# EAGLE schematic trainer2 (EAGLE 7.3.0)
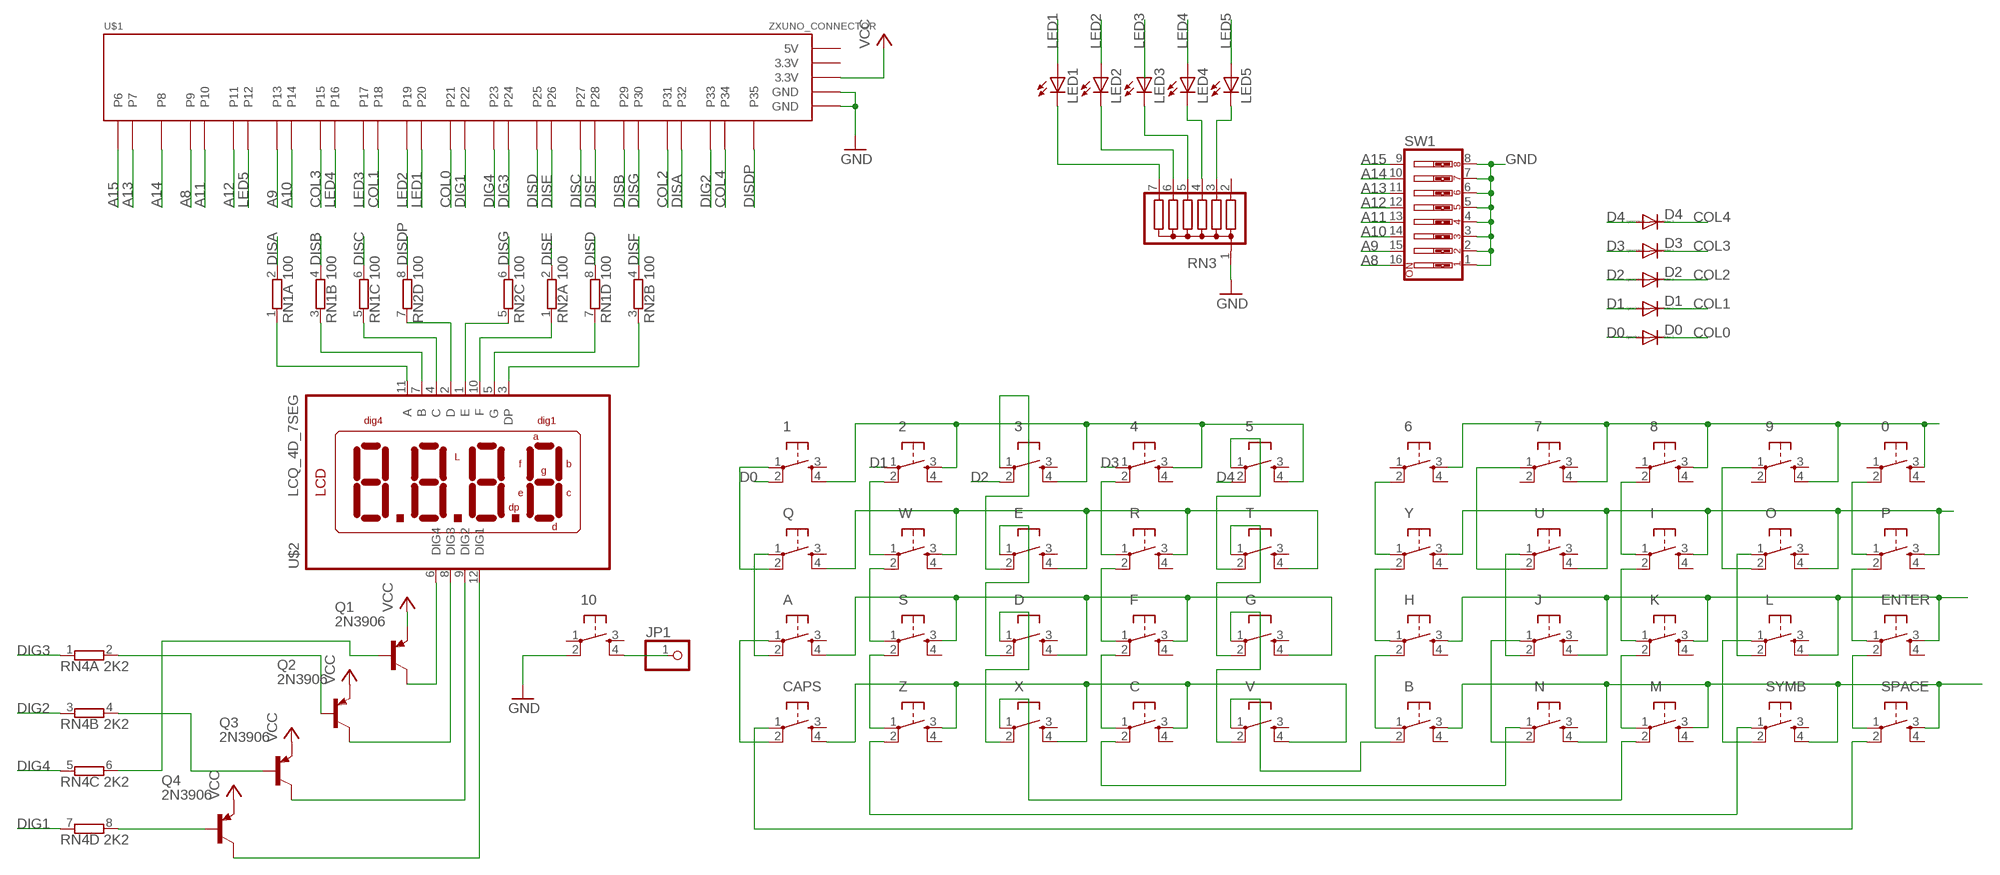
[diagram p0: schematic, sheet 1]

## Parts
0  DTS-6  [DTS-6]
1  DTS-6  [DTS-6]
2  DTS-6  [DTS-6]
3  DTS-6  [DTS-6]
4  DTS-6  [DTS-6]
5  DTS-6  [DTS-6]
6  DTS-6  [DTS-6]
7  DTS-6  [DTS-6]
8  DTS-6  [DTS-6]
9  DTS-6  [DTS-6]
10  DTS-6  [DTS-6]
A  DTS-6  [DTS-6]
B  DTS-6  [DTS-6]
C  DTS-6  [DTS-6]
CAPS  DTS-6  [DTS-6]
D  DTS-6  [DTS-6]
D0  1N4148DO35-7  [DO35-7]
D1  1N4148DO35-7  [DO35-7]
D2  1N4148DO35-7  [DO35-7]
D3  1N4148DO35-7  [DO35-7]
D4  1N4148DO35-7  [DO35-7]
E  DTS-6  [DTS-6]
ENTER  DTS-6  [DTS-6]
F  DTS-6  [DTS-6]
G  DTS-6  [DTS-6]
H  DTS-6  [DTS-6]
I  DTS-6  [DTS-6]
J  DTS-6  [DTS-6]
JP1  PINHD-1X1  [1X01]
K  DTS-6  [DTS-6]
L  DTS-6  [DTS-6]
LED1  LED3MM  [LED3MM]
LED2  LED3MM  [LED3MM]
LED3  LED3MM  [LED3MM]
LED4  LED3MM  [LED3MM]
LED5  LED3MM  [LED3MM]
M  DTS-6  [DTS-6]
N  DTS-6  [DTS-6]
O  DTS-6  [DTS-6]
P  DTS-6  [DTS-6]
Q  DTS-6  [DTS-6]
Q1  2N3906  [TO92]
Q2  2N3906  [TO92]
Q3  2N3906  [TO92]
Q4  2N3906  [TO92]
R  DTS-6  [DTS-6]
RN1  100  E4R  [SIL8]
RN2  100  E4R  [SIL8]
RN3  G06R  [SIL7]
RN4  2K2  E4R  [SIL8]
S  DTS-6  [DTS-6]
SPACE  DTS-6  [DTS-6]
SW1  SW_DIP-8  [EDG-08]
SYMB  DTS-6  [DTS-6]
T  DTS-6  [DTS-6]
U  DTS-6  [DTS-6]
U$1  ZXUNO_CONNECTOR  [ZXUNO_CONNECTOR]
U$2  LCQ_4D_7SEG  [LDQ_4D_7SEG]
V  DTS-6  [DTS-6]
W  DTS-6  [DTS-6]
X  DTS-6  [DTS-6]
Y  DTS-6  [DTS-6]
Z  DTS-6  [DTS-6]

## Nets
A8: C.3 CAPS.4 SW1.16 U$1.P9 V.4 X.4 Z.3
A9: A.4 D.4 F.3 G.4 S.3 SW1.15 U$1.P13
A10: E.4 Q.4 R.3 SW1.14 T.4 U$1.P14 W.3
A11: 1.4 2.3 3.4 4.3 5.4 SW1.13 U$1.P10
A12: 0.3 6.3 7.4 8.3 9.4 SW1.12 U$1.P11
A13: I.3 O.4 P.3 SW1.11 U$1.P7 U.4 Y.3
A14: ENTER.3 H.3 J.4 K.3 L.4 SW1.10 U$1.P8
A15: B.3 M.3 N.4 SPACE.3 SW1.9 SYMB.4 U$1.P6
COL0: D0.C U$1.P21
COL1: D1.C U$1.P18
COL2: D2.C U$1.P31
COL3: D3.C U$1.P15
COL4: D4.C U$1.P34
D0: 1.2 D0.A
D1: 2.1 D1.A
D2: 3.2 D2.A
D3: 4.1 D3.A
D4: 5.2 D4.A
DIG1: RN4.7 U$1.P22
DIG2: RN4.3 U$1.P33
DIG3: RN4.1 U$1.P24
DIG4: RN4.5 U$1.P23
DISA: RN1.2 U$1.P32
DISB: RN1.4 U$1.P29
DISC: RN1.6 U$1.P27
DISD: RN1.8 U$1.P25
DISDP: RN2.8 U$1.P35
DISE: RN2.2 U$1.P26
DISF: RN2.4 U$1.P28
DISG: RN2.6 U$1.P30
ELETE: M.2 X.1
GND: 10.2 RN3.1 SW1.1 SW1.2 SW1.3 SW1.4 SW1.5 SW1.6 SW1.7 SW1.8 U$1.GND@1(GND) U$1.GND@2(GND)
LED1: LED1.A U$1.P20
LED2: LED2.A U$1.P19
LED3: LED3.A U$1.P17
LED4: LED4.A U$1.P16
LED5: LED5.A U$1.P12
N$1: Q1.1(C) U$2.6(DIG4)
N$2: Q2.1(C) U$2.8(DIG3)
N$3: Q3.1(C) U$2.9(DIG2)
N$4: Q4.1(C) U$2.12(DIG1)
N$5: Q2.2(B) RN4.2
N$6: Q1.2(B) RN4.6
N$7: Q3.2(B) RN4.4
N$8: Q4.2(B) RN4.8
N$9: RN1.1 U$2.11(A)
N$10: RN1.3 U$2.7(B)
N$11: RN1.5 U$2.4(C)
N$12: RN2.7 U$2.2(D)
N$13: RN2.5 U$2.1(E)
N$14: RN2.1 U$2.10(F)
N$15: 10.4 JP1.1
N$16: S.1 W.2
N$17: S.2 Z.1
N$18: RN2.3 U$2.3(DP)
N$19: SYMB.1 Z.2
N$20: RN1.7 U$2.5(G)
N$21: C.1 F.2
N$22: CAPS.1 SPACE.2
N$23: 4.2 R.1
N$24: F.1 R.2
N$25: LED4.K(C) RN3.4
N$26: LED5.K(C) RN3.3
N$27: LED3.K(C) RN3.5
N$28: B.2 V.1
N$29: 5.1 T.2
N$30: G.2 T.1
N$31: A.2 Q.1
N$32: J.2 U.1
N$33: J.1 N.2
N$34: 3.1 E.2
N$35: D.2 E.1
N$36: A.1 CAPS.2
N$37: 1.1 Q.2
N$38: K.2 M.1
N$39: 2.2 W.1
N$40: 7.1 U.2
N$41: LED2.K(C) RN3.6
N$42: G.1 V.2
N$43: C.2 N.1
N$44: L.1 SYMB.2
N$46: LED1.K(C) RN3.7
N$47: I.2 K.1
N$48: 8.2 I.1
N$49: L.2 O.1
N$50: B.1 H.2
N$51: H.1 Y.2
N$52: ENTER.2 SPACE.1
N$53: ENTER.1 P.2
N$54: 0.2 P.1
N$55: 6.2 Y.1
N$56: 9.1 O.2
N$74: D.1 X.2
VCC: Q1.3(E) Q2.3(E) Q3.3(E) Q4.3(E) U$1.3.3V@2(3.3V)
Unconnected: 0.1 0.4 1.3 2.4 3.3 4.4 5.3 6.1 6.4 7.2 7.3 8.1 8.4 9.2 9.3 10.1 10.3 A.3 B.4 C.4 CAPS.3 D.3 E.3 ENTER.4 F.4 G.3 H.4 I.4 J.3 K.4 L.3 M.4 N.3 O.3 P.4 Q.3 R.4 RN3.2 S.4 SPACE.4 SYMB.3 T.3 U.3 V.3 W.4 X.3 Y.4 Z.4

## Power pins joined to a net without a drawn wire
3.3V: U$1.3.3V@1(3.3V)
5V: U$1.5V

## Library data of the parts
0 1-10 A B C CAPS D E ENTER F G H I J K L M N O P Q R S SPACE SYMB T U V W X Y Z = switch-tact:DTS-6
D0 D1-D4 = diode:1N4148: DIODE high speed (Philips)
JP1 = pinhead:PINHD-1X1: PIN HEADER
LED1-LED5 = led:LED: LED OSRAM: - CHIPLED LG R971, LG N971, LY N971, LG Q971, LY Q971, LO R971, LY R971 LH N974, LH R974 LS Q976, LO Q976, LY Q976 LO Q996 - Hyper CHIPLED LW Q18S LB Q993, LB Q99A, LB R99A - SideLED LS A670, LO A670, LY A670, LG A670, LP A670 LB A673, LV A673, LT A673, LW A673 LH A674 LY A675 LS A676, LA A676, LO A676, LY A676, LW A676 LS A679, LY A679, LG A679 - Hyper Micro SIDELED® LS Y876, LA Y876, LO Y876, LY Y876 LT Y87S - SmartLED LW L88C, LW L88S LB L89C, LB L89S, LG L890 LS L89K, LO L89K, LY L89K LS L896, LA L896, LO L896, LY L896 - TOPLED LS T670, LO T670, LY T670, LG T670, LP T670 LSG T670, LSP T670, LSY T670, LOP T670, LYG T670 LG T671, LOG T671, LSG T671 LB T673, LV T673, LT T673, LW T673 LH T674 LS T676, LA T676, LO T676, LY T676, LB T676, LH T676, LSB T676, LW T676 LB T67C, LV T67C, LT T67C, LS T67K, LO T67K, LY T67K, LW E67C LS E67B, LA E67B, LO E67B, LY E67B, LB E67C, LV E67C, LT E67C LW T67C LS T679, LY T679, LG T679 LS T770, LO T770, LY T770, LG T770, LP T770 LB T773, LV T773, LT T773, LW T773 LH T774 LS E675, LA E675, LY E675, LS T675 LS T776, LA T776, LO T776, LY T776, LB T776 LHGB T686 LT T68C, LB T68C - Hyper Mini TOPLED® LB M676 - Mini TOPLED Santana® LG M470 LS M47K, LO M47K, LY M47K Source: http://www.osram.convergy.de LUXEON: - LUMILED® LXK2-PW12-R00, LXK2-PW12-S00, LXK2-PW14-U00, LXK2-PW14-V00 LXK2-PM12-R00, LXK2-PM12-S00, LXK2-PM14-U00 LXK2-PE12-Q00, LXK2-PE12-R00, LXK2-PE12-S00, LXK2-PE14-T00, LXK2-PE14-U00 LXK2-PB12-K00, LXK2-PB12-L00, LXK2-PB12-M00, LXK2-PB14-N00, LXK2-PB14-P00, LXK2-PB14-Q00 LXK2-PR12-L00, LXK2-PR12-M00, LXK2-PR14-Q00, LXK2-PR14-R00 LXK2-PD12-Q00, LXK2-PD12-R00, LXK2-PD12-S00 LXK2-PH12-R00, LXK2-PH12-S00 LXK2-PL12-P00, LXK2-PL12-Q00, LXK2-PL12-R00 Source: www.luxeon.com KINGBRIGHT: KA-3528ASYC Source: www.kingbright.com
Q1-Q4 = transistor-pnp:2N3906: PNP Transistor
RN1 RN2 RN4 = resistor-sil:E4R: SIL RESISTOR; OC_FARNELL: unknown; OC_NEWARK: unknown
RN3 = resistor-sil:G06R: SIL RESISTOR; OC_FARNELL: unknown; OC_NEWARK: unknown
SW1 = special:SW_DIP-8: DIP SWITCH
U$1 = zxuno:ZXUNO_CONNECTOR
U$2 = mylib:LCQ_4D_7SEG